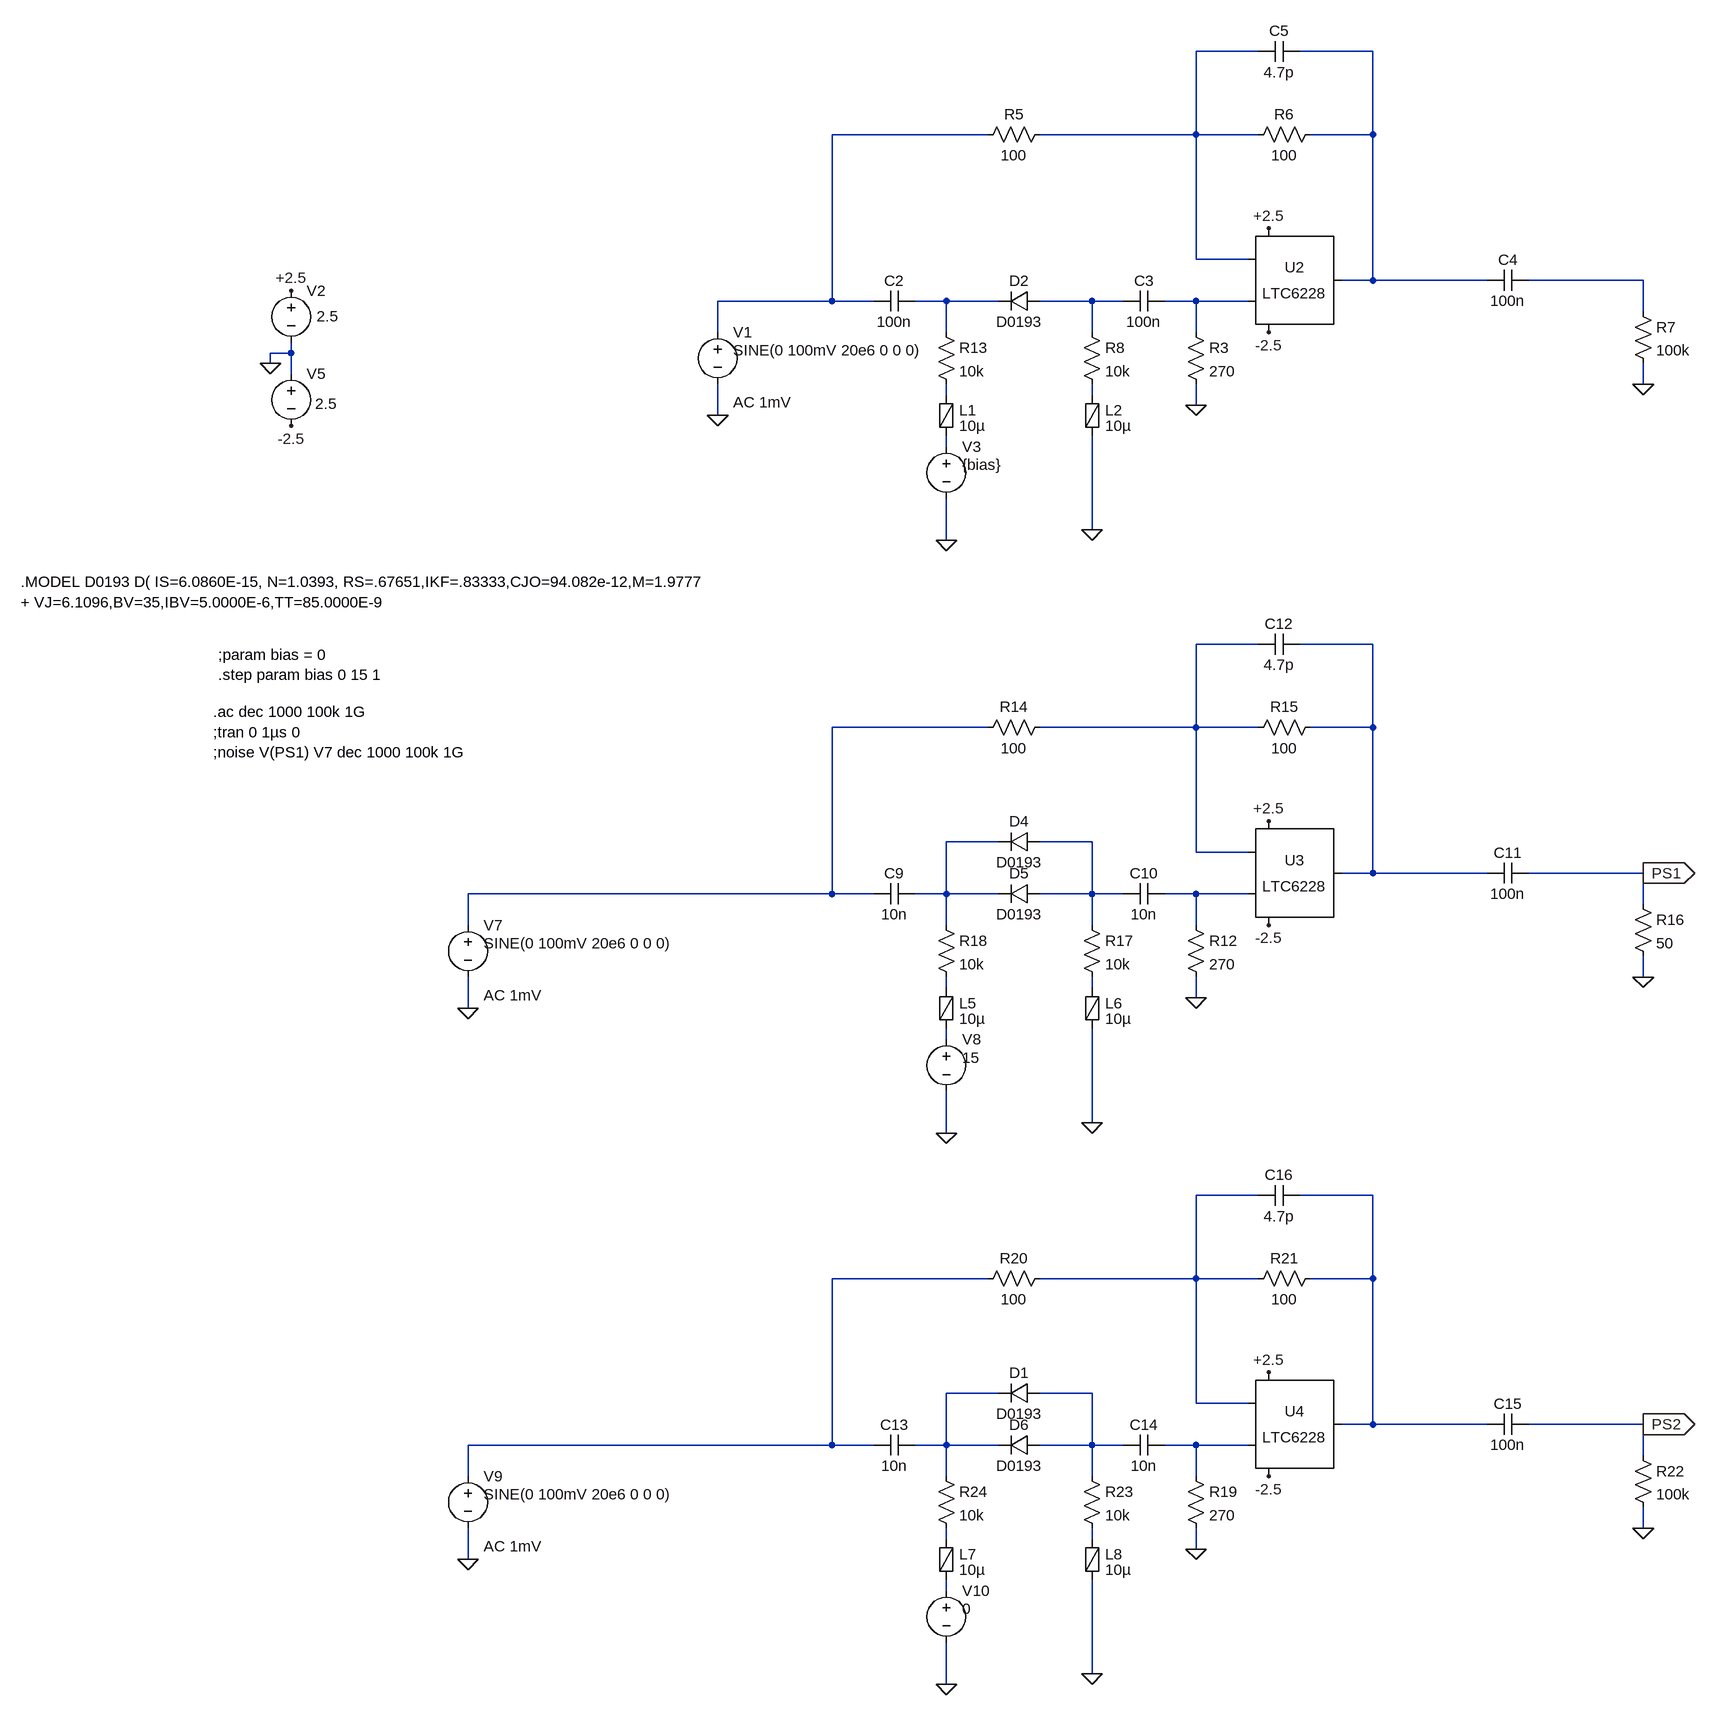
[diagram p0: schematic phase_shifter.asc]
phase_shifter.asc, the LTspice schematic file:
Version 4
SHEET 1 3748 3188
WIRE 336 656 240 656
WIRE 512 656 400 656
WIRE -80 784 -320 784
WIRE 240 784 240 656
WIRE 240 784 0 784
WIRE 336 784 240 784
WIRE 512 784 512 656
WIRE 512 784 416 784
WIRE 240 976 240 784
WIRE 320 976 240 976
WIRE 512 1008 512 784
WIRE 512 1008 464 1008
WIRE 688 1008 512 1008
WIRE 928 1008 752 1008
WIRE -320 1040 -320 784
WIRE -320 1040 -496 1040
WIRE -256 1040 -320 1040
WIRE -144 1040 -192 1040
WIRE -64 1040 -144 1040
WIRE 80 1040 0 1040
WIRE 128 1040 80 1040
WIRE 240 1040 192 1040
WIRE 320 1040 240 1040
WIRE 928 1056 928 1008
WIRE -496 1088 -496 1040
WIRE -144 1088 -144 1040
WIRE 80 1088 80 1040
WIRE 240 1088 240 1040
WIRE -1152 1120 -1152 1104
WIRE -1152 1120 -1184 1120
WIRE -1184 1136 -1184 1120
WIRE -1152 1152 -1152 1120
WIRE 928 1168 928 1136
WIRE -144 1184 -144 1168
WIRE 80 1184 80 1168
WIRE 240 1200 240 1168
WIRE -496 1216 -496 1168
WIRE -144 1264 -144 1248
WIRE 80 1392 80 1248
WIRE -144 1408 -144 1344
WIRE 336 1568 240 1568
WIRE 512 1568 400 1568
WIRE -80 1696 -320 1696
WIRE 240 1696 240 1568
WIRE 240 1696 0 1696
WIRE 336 1696 240 1696
WIRE 512 1696 512 1568
WIRE 512 1696 416 1696
WIRE -64 1872 -144 1872
WIRE 80 1872 0 1872
WIRE 240 1888 240 1696
WIRE 320 1888 240 1888
WIRE 512 1920 512 1696
WIRE 512 1920 464 1920
WIRE 688 1920 512 1920
WIRE 928 1920 752 1920
WIRE -320 1952 -320 1696
WIRE -320 1952 -880 1952
WIRE -256 1952 -320 1952
WIRE -144 1952 -144 1872
WIRE -144 1952 -192 1952
WIRE -64 1952 -144 1952
WIRE 80 1952 80 1872
WIRE 80 1952 0 1952
WIRE 128 1952 80 1952
WIRE 240 1952 192 1952
WIRE 320 1952 240 1952
WIRE 928 1968 928 1920
WIRE -880 2000 -880 1952
WIRE -144 2000 -144 1952
WIRE 80 2000 80 1952
WIRE 240 2000 240 1952
WIRE 928 2080 928 2048
WIRE -144 2096 -144 2080
WIRE 80 2096 80 2080
WIRE 240 2112 240 2080
WIRE -880 2128 -880 2080
WIRE -144 2176 -144 2160
WIRE 80 2304 80 2160
WIRE -144 2320 -144 2256
WIRE 336 2416 240 2416
WIRE 512 2416 400 2416
WIRE -80 2544 -320 2544
WIRE 240 2544 240 2416
WIRE 240 2544 0 2544
WIRE 336 2544 240 2544
WIRE 512 2544 512 2416
WIRE 512 2544 416 2544
WIRE -64 2720 -144 2720
WIRE 80 2720 0 2720
WIRE 240 2736 240 2544
WIRE 320 2736 240 2736
WIRE 512 2768 512 2544
WIRE 512 2768 464 2768
WIRE 688 2768 512 2768
WIRE 928 2768 752 2768
WIRE -320 2800 -320 2544
WIRE -320 2800 -880 2800
WIRE -256 2800 -320 2800
WIRE -144 2800 -144 2720
WIRE -144 2800 -192 2800
WIRE -64 2800 -144 2800
WIRE 80 2800 80 2720
WIRE 80 2800 0 2800
WIRE 128 2800 80 2800
WIRE 240 2800 192 2800
WIRE 320 2800 240 2800
WIRE 928 2816 928 2768
WIRE -880 2848 -880 2800
WIRE -144 2848 -144 2800
WIRE 80 2848 80 2800
WIRE 240 2848 240 2800
WIRE 928 2928 928 2896
WIRE -144 2944 -144 2928
WIRE 80 2944 80 2928
WIRE 240 2960 240 2928
WIRE -880 2976 -880 2928
WIRE -144 3024 -144 3008
WIRE 80 3152 80 3008
WIRE -144 3168 -144 3104
FLAG -1184 1136 0
FLAG -1152 1024 +2.5
FLAG -1152 1232 -2.5
FLAG 352 928 +2.5
FLAG 352 1088 -2.5
FLAG -496 1216 0
FLAG 240 1200 0
FLAG 928 1168 0
FLAG 80 1392 0
FLAG -144 1408 0
FLAG 352 1840 +2.5
FLAG 352 2000 -2.5
FLAG -880 2128 0
FLAG 240 2112 0
FLAG 928 2080 0
FLAG 80 2304 0
FLAG -144 2320 0
FLAG 352 2688 +2.5
FLAG 352 2848 -2.5
FLAG -880 2976 0
FLAG 240 2960 0
FLAG 928 2928 0
FLAG 80 3152 0
FLAG -144 3168 0
FLAG 928 1920 PS1
IOPIN 928 1920 Out
FLAG 928 2768 PS2
IOPIN 928 2768 Out
SYMBOL voltage -1152 1008 R0
WINDOW 123 0 0 Left 0
WINDOW 39 0 0 Left 0
WINDOW 3 39 55 Left 2
SYMATTR Value 2.5
SYMATTR InstName V2
SYMBOL voltage -1152 1136 R0
WINDOW 123 0 0 Left 0
WINDOW 39 0 0 Left 0
WINDOW 3 37 62 Left 2
SYMATTR Value 2.5
SYMATTR InstName V5
SYMBOL voltage -496 1072 R0
WINDOW 123 24 124 Left 2
WINDOW 39 0 0 Left 0
WINDOW 3 24 44 Left 2
SYMATTR Value2 AC 1mV
SYMATTR Value SINE(0 100mV 20e6 0 0 0)
SYMATTR InstName V1
SYMBOL res 224 1072 R0
SYMATTR InstName R3
SYMATTR Value 270
SYMBOL res 16 768 R90
WINDOW 0 0 56 VBottom 2
WINDOW 3 32 56 VTop 2
SYMATTR InstName R5
SYMATTR Value 100
SYMBOL res 432 768 R90
WINDOW 0 0 56 VBottom 2
WINDOW 3 32 56 VTop 2
SYMATTR InstName R6
SYMATTR Value 100
SYMBOL res 912 1040 R0
SYMATTR InstName R7
SYMATTR Value 100k
SYMBOL cap -192 1024 R90
WINDOW 0 0 32 VBottom 2
WINDOW 3 32 32 VTop 2
SYMATTR InstName C2
SYMATTR Value 100n
SYMBOL cap 192 1024 R90
WINDOW 0 0 32 VBottom 2
WINDOW 3 32 32 VTop 2
SYMATTR InstName C3
SYMATTR Value 100n
SYMBOL res 64 1072 R0
SYMATTR InstName R8
SYMATTR Value 10k
SYMBOL voltage -144 1248 R0
WINDOW 3 24 44 Left 2
WINDOW 123 24 72 Left 2
WINDOW 39 0 0 Left 0
SYMATTR Value {bias}
SYMATTR InstName V3
SYMBOL OpAmps\\LTC6228 352 1008 R0
SYMATTR InstName U2
SYMBOL diode 0 1024 R90
WINDOW 0 0 32 VBottom 2
WINDOW 3 32 32 VTop 2
SYMATTR InstName D2
SYMATTR Value D0193
SYMBOL cap 752 992 R90
WINDOW 0 0 32 VBottom 2
WINDOW 3 32 32 VTop 2
SYMATTR InstName C4
SYMATTR Value 100n
SYMBOL res -160 1072 R0
SYMATTR InstName R13
SYMATTR Value 10k
SYMBOL FerriteBead -144 1216 R0
SYMATTR InstName L1
SYMATTR Value 10µ
SYMBOL cap 400 640 R90
WINDOW 0 0 32 VBottom 2
WINDOW 3 32 32 VTop 2
SYMATTR InstName C5
SYMATTR Value 4.7p
SYMBOL FerriteBead 80 1216 R0
SYMATTR InstName L2
SYMATTR Value 10µ
SYMBOL voltage -880 1984 R0
WINDOW 123 24 124 Left 2
WINDOW 39 0 0 Left 0
WINDOW 3 24 44 Left 2
SYMATTR Value2 AC 1mV
SYMATTR Value SINE(0 100mV 20e6 0 0 0)
SYMATTR InstName V7
SYMBOL res 224 1984 R0
SYMATTR InstName R12
SYMATTR Value 270
SYMBOL res 16 1680 R90
WINDOW 0 0 56 VBottom 2
WINDOW 3 32 56 VTop 2
SYMATTR InstName R14
SYMATTR Value 100
SYMBOL res 432 1680 R90
WINDOW 0 0 56 VBottom 2
WINDOW 3 32 56 VTop 2
SYMATTR InstName R15
SYMATTR Value 100
SYMBOL res 912 1952 R0
SYMATTR InstName R16
SYMATTR Value 50
SYMBOL cap -192 1936 R90
WINDOW 0 0 32 VBottom 2
WINDOW 3 32 32 VTop 2
SYMATTR InstName C9
SYMATTR Value 10n
SYMBOL cap 192 1936 R90
WINDOW 0 0 32 VBottom 2
WINDOW 3 32 32 VTop 2
SYMATTR InstName C10
SYMATTR Value 10n
SYMBOL res 64 1984 R0
SYMATTR InstName R17
SYMATTR Value 10k
SYMBOL voltage -144 2160 R0
WINDOW 3 24 44 Left 2
WINDOW 123 24 72 Left 2
WINDOW 39 0 0 Left 0
SYMATTR Value 15
SYMATTR InstName V8
SYMBOL OpAmps\\LTC6228 352 1920 R0
SYMATTR InstName U3
SYMBOL diode 0 1936 R90
WINDOW 0 0 32 VBottom 2
WINDOW 3 32 32 VTop 2
SYMATTR InstName D5
SYMATTR Value D0193
SYMBOL cap 752 1904 R90
WINDOW 0 0 32 VBottom 2
WINDOW 3 32 32 VTop 2
SYMATTR InstName C11
SYMATTR Value 100n
SYMBOL res -160 1984 R0
SYMATTR InstName R18
SYMATTR Value 10k
SYMBOL FerriteBead -144 2128 R0
SYMATTR InstName L5
SYMATTR Value 10µ
SYMBOL cap 400 1552 R90
WINDOW 0 0 32 VBottom 2
WINDOW 3 32 32 VTop 2
SYMATTR InstName C12
SYMATTR Value 4.7p
SYMBOL FerriteBead 80 2128 R0
SYMATTR InstName L6
SYMATTR Value 10µ
SYMBOL voltage -880 2832 R0
WINDOW 123 24 124 Left 2
WINDOW 39 0 0 Left 0
WINDOW 3 24 44 Left 2
SYMATTR Value2 AC 1mV
SYMATTR Value SINE(0 100mV 20e6 0 0 0)
SYMATTR InstName V9
SYMBOL res 224 2832 R0
SYMATTR InstName R19
SYMATTR Value 270
SYMBOL res 16 2528 R90
WINDOW 0 0 56 VBottom 2
WINDOW 3 32 56 VTop 2
SYMATTR InstName R20
SYMATTR Value 100
SYMBOL res 432 2528 R90
WINDOW 0 0 56 VBottom 2
WINDOW 3 32 56 VTop 2
SYMATTR InstName R21
SYMATTR Value 100
SYMBOL res 912 2800 R0
SYMATTR InstName R22
SYMATTR Value 100k
SYMBOL cap -192 2784 R90
WINDOW 0 0 32 VBottom 2
WINDOW 3 32 32 VTop 2
SYMATTR InstName C13
SYMATTR Value 10n
SYMBOL cap 192 2784 R90
WINDOW 0 0 32 VBottom 2
WINDOW 3 32 32 VTop 2
SYMATTR InstName C14
SYMATTR Value 10n
SYMBOL res 64 2832 R0
SYMATTR InstName R23
SYMATTR Value 10k
SYMBOL voltage -144 3008 R0
WINDOW 3 24 44 Left 2
WINDOW 123 24 72 Left 2
WINDOW 39 0 0 Left 0
SYMATTR Value 0
SYMATTR InstName V10
SYMBOL OpAmps\\LTC6228 352 2768 R0
SYMATTR InstName U4
SYMBOL diode 0 2784 R90
WINDOW 0 0 32 VBottom 2
WINDOW 3 32 32 VTop 2
SYMATTR InstName D6
SYMATTR Value D0193
SYMBOL cap 752 2752 R90
WINDOW 0 0 32 VBottom 2
WINDOW 3 32 32 VTop 2
SYMATTR InstName C15
SYMATTR Value 100n
SYMBOL res -160 2832 R0
SYMATTR InstName R24
SYMATTR Value 10k
SYMBOL FerriteBead -144 2976 R0
SYMATTR InstName L7
SYMATTR Value 10µ
SYMBOL cap 400 2400 R90
WINDOW 0 0 32 VBottom 2
WINDOW 3 32 32 VTop 2
SYMATTR InstName C16
SYMATTR Value 4.7p
SYMBOL FerriteBead 80 2976 R0
SYMATTR InstName L8
SYMATTR Value 10µ
SYMBOL diode 0 2704 R90
WINDOW 0 0 32 VBottom 2
WINDOW 3 32 32 VTop 2
SYMATTR InstName D1
SYMATTR Value D0193
SYMBOL diode 0 1856 R90
WINDOW 0 0 32 VBottom 2
WINDOW 3 32 32 VTop 2
SYMATTR InstName D4
SYMATTR Value D0193
TEXT -1264 1584 Left 2 !;param bias = 0\n.step param bias 0 15 1
TEXT -1568 1472 Left 2 !.MODEL D0193 D( IS=6.0860E-15, N=1.0393, RS=.67651,IKF=.83333,CJO=94.082e-12,M=1.9777\n+ VJ=6.1096,BV=35,IBV=5.0000E-6,TT=85.0000E-9
TEXT -1272 1672 Left 2 !.ac dec 1000 100k 1G\n;tran 0 1µs 0\n;noise V(PS1) V7 dec 1000 100k 1G

The netlist it stands for:
* phase_shifter.asc
V2 +2.5 0 2.5
V5 0 -2.5 2.5
V1 N003 0 SINE(0 100mV 20e6 0 0 0) AC 1mV
R3 N007 0 270
R5 N001 N003 100
R6 N002 N001 100
R7 N004 0 100k
C2 N005 N003 100n
C3 N007 N006 100n
R8 N006 N009 10k
V3 N010 0 {bias}
XU2 N007 N001 N002 +2.5 -2.5 NC_01 LTC6228
D2 N006 N005 D0193
C4 N004 N002 100n
R13 N005 N008 10k
L1 N008 N010 10µ
C5 N002 N001 4.7p
L2 N009 0 10µ
V7 N013 0 SINE(0 100mV 20e6 0 0 0) AC 1mV
R12 N016 0 270
R14 N011 N013 100
R15 N012 N011 100
R16 PS1 0 50
C9 N014 N013 10n
C10 N016 N015 10n
R17 N015 N018 10k
V8 N019 0 15
XU3 N016 N011 N012 +2.5 -2.5 NC_02 LTC6228
D5 N015 N014 D0193
C11 PS1 N012 100n
R18 N014 N017 10k
L5 N017 N019 10µ
C12 N012 N011 4.7p
L6 N018 0 10µ
V9 N022 0 SINE(0 100mV 20e6 0 0 0) AC 1mV
R19 N025 0 270
R20 N020 N022 100
R21 N021 N020 100
R22 PS2 0 100k
C13 N023 N022 10n
C14 N025 N024 10n
R23 N024 N027 10k
V10 N028 0 0
XU4 N025 N020 N021 +2.5 -2.5 NC_03 LTC6228
D6 N024 N023 D0193
C15 PS2 N021 100n
R24 N023 N026 10k
L7 N026 N028 10µ
C16 N021 N020 4.7p
L8 N027 0 10µ
D1 N024 N023 D0193
D4 N015 N014 D0193
.model D D
.lib standard.dio
;param bias = 0
.step param bias 0 15 1
.MODEL D0193 D( IS=6.0860E-15, N=1.0393, RS=.67651,IKF=.83333,CJO=94.082e-12,M=1.9777
+ VJ=6.1096,BV=35,IBV=5.0000E-6,TT=85.0000E-9
.ac dec 1000 100k 1G
;tran 0 1µs 0
;noise V(PS1) V7 dec 1000 100k 1G
.backanno
.end